# Altium schematic sheet PAGE03_POWER SUPPLY.SchDoc
size 330 x 203 mm
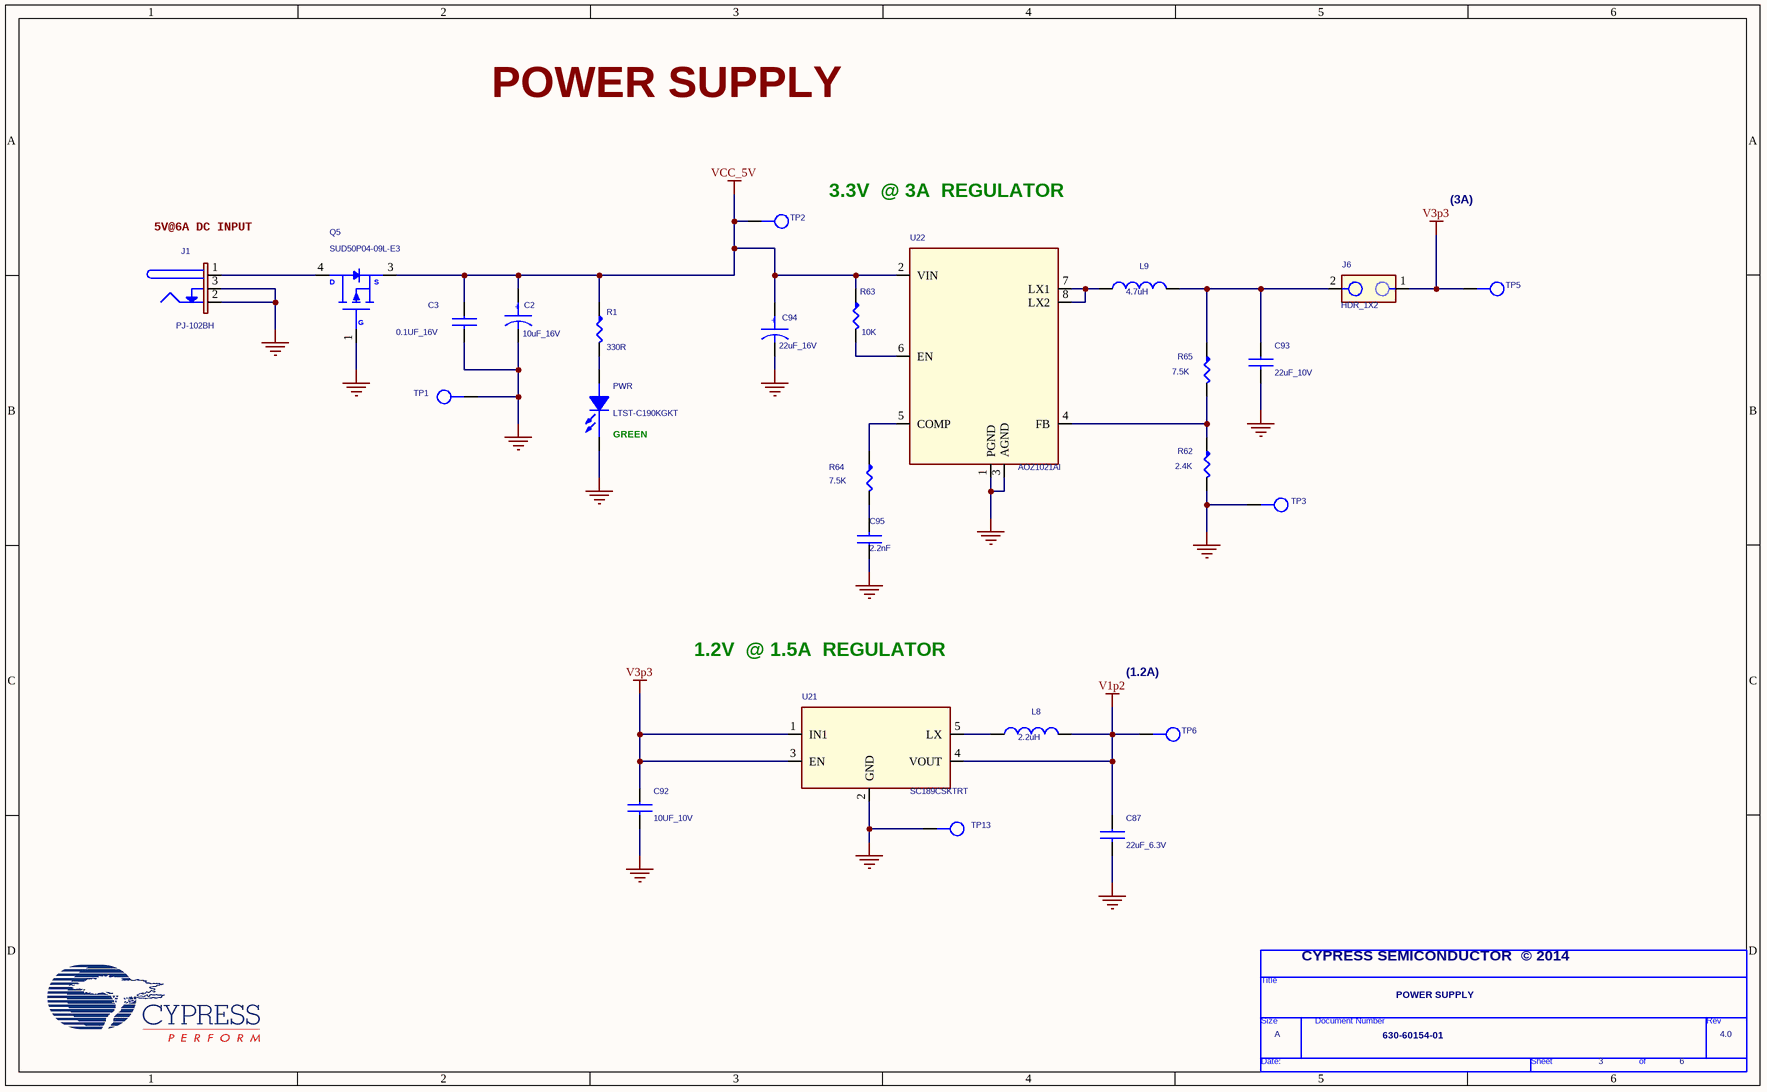
[diagram p0: PAGE03_POWER SUPPLY.SchDoc]

## Parts
*  Page Count: 6  Page Number: 3  Page Size: A  Title: POWER SUPPLY  RevCode: 4.0  Doc: 630-60154-01  (hidden comment: TitleBlock0)  (graphical)
C2  10uF_16V  [CAPMP3216X180M]
C3  0.1UF_16V  [CAPC1005X56M]
C87  22uF_6.3V  [CAPC3216X100M]
C92  10UF_10V  [CAPC2012X145M]
C93  22uF_10V  [CAPC3216X100M]
C94  22uF_16V  [CAPCP3216X100M]
C95  2.2nF  [CAPC2112X70M]
J1  PJ-102BH  [CUI_PJ-102BH]
J6  HDR_1X2  [SAMTEC_TSW-102-08-G-S]
L8  2.2uH  [INDP3225X240M]
L9  4.7uH  [IND_NR6028T4R7M]
PWR  LTST-C190KGKT  [LEDC1608X80M]
Q5  SUD50P04-09L-E3  [TO228P991X238-3M]
R1  330R  [RESC1608X55M]
R62  2.4K  [RESC1608X55M]
R63  10K  [RESC1608X55M]
R64  7.5K  [RESC1608X55M]
R65  7.5K  [RESC1608X55M]
TP1  TP_BLACK  [KEYSTONE_5000]  (value not drawn)
TP2  TP_RED  [KEYSTONE_5000]  (value not drawn)
TP3  TP_BLACK  [KEYSTONE_5000]  (value not drawn)
TP5  TP_RED  [KEYSTONE_5000]  (value not drawn)
TP6  TP_RED  [KEYSTONE_5000]  (value not drawn)
TP13  TP_BLACK  [KEYSTONE_5000]  (value not drawn)
U21  SC189CSKTRT  [SOT95P280X145-5M]
U22  AOZ1021AI  [SOIC127P600X175-8M]

## Nets
GND: C2.2 C3.2 C87.2 C92.2 C93.2 C94.2 C95.1 J1.2 J1.3 PWR.2(CATHODE) Q5.1(G) R62.2 TP1.1(TP) TP3.1(TP) TP13.1(TP) U21.2(GND) U22.1(PGND) U22.3(AGND)
V1p2: C87.1 L8.2 TP6.1(TP) U21.4(VOUT)
V3p3: C92.1 J6.1 TP5.1(TP) U21.1(IN1) U21.3(EN)
VCC_5V: C2.1 C3.1 C94.1 Q5.3(S) R1.1 R63.1 TP2.1(TP) U22.2(VIN)
NetC93_1: C93.1 J6.2 L9.2 R65.1
NetC95_2: C95.2 R64.2
NetJ1_1: J1.1 Q5.4(D)
NetL8_1: L8.1 U21.5(LX)
NetL9_1: L9.1 U22.7(LX1) U22.8(LX2)
NetPWR_1: PWR.1(ANODE) R1.2
NetR62_1: R62.1 R65.2 U22.4(FB)
NetR63_2: R63.2 U22.6(EN)
NetR64_1: R64.1 U22.5(COMP)

## Notes on the sheet
- POWER SUPPLY
- (near J1) 5V@6A DC INPUT
- 3.3V  @ 3A  REGULATOR
- (3A)
- (near PWR) GREEN
- 1.2V  @ 1.5A  REGULATOR
- (1.2A)
- (near *) CYPRESS SEMICONDUCTOR  © 2014
- (in symbol CAP POL) +
- (in symbol TitleBlock0) Title; Size; Document Number; Rev; Date:; Sheet; of

## Library data of the parts
C2 = CAP POL: CAP TANT 10UF 16V 20% 1206; Part Number: TAJA106M016RNJ; Manufacturer: AVX Corporation; Lead Free: YES; Decription: CAP TANT 10UF 16V 20% 1206
C3 C87 C92 C93 = CAPACITOR NON-POL: Manufacturer: *; Part Number: *
C94 = CAP POL: CAP TANT 22UF 16V 10% 1206; Manufacturer: Nichicon; Part Number: F951C226KQAAQ2; RoHS Compliant: Yes; Lead Free Status: No
C95 = CAPACITOR NON-POL: CAP CER 2200PF 50V 10% X7R 0805; Manufacturer: Yageo; Part Number: CC0805KRX7R9BB222; Num Pins: 2; RoHS Compliant: Yes; Lead Free: YES
J1 = PowerJack: CONN PWR JACK 2.5X5.5MM HIGH CUR; Manufacturer: CUI Inc; LEAD FREE: Y; Type: Power Jack; MFG:: CUI Inc; Part Number: PJ-102BH
J6 = HEADER_1x2: Manufacturer: Samtec Inc; Part Number: TSW-102-08-G-S; Lead Free: YES
L8 = INDUCTOR: INDUCTOR 2.2UH 1.20A 20% 1210; Part Number: NLCV32T-2R2M-PFR; Manufacturer: TDK Corporation; Lead Free: YES
L9 = INDUCTOR: INDUCTOR 4.7UH 2.7A 20% SMD; Part Number: NR6028T4R7M; Manufacturer: Taiyo Yuden; Lead Free: YES
PWR = LED: LED GREEN CLEAR 0603 SMD; Manufacturer: Lite-On; Voltage Rating: 2V; CURRENT: 20mA; Part Number: LTST-C190KGKT
R1 = R_Dup1: RES 180 OHM 1/16W 1% 0402 SMD; Manufacturer: Vishay; Part Number: CRCW0402180RFKED
R62 = R_Dup1: RES 2.4K OHM 1/10W 1% 0603 SMD; Manufacturer: Panasonic - ECG; Part Number: ERJ-3EKF2401V; Lead Free: YES
R63 = R_Dup1: RES 10.0K OHM 1/10W 1% 0603 SMD; Manufacturer: Panasonic - ECG; Part Number: ERJ-3EKF1002V; Lead Free: YES
R64 = R_Dup1: RES 7.5K OHM 1/10W 1% 0603 SMD; Part Number: ERJ-3EKF7501V; Manufacturer: Panasonic - ECG; Lead Free: YES
R65 = R_Dup1: RES 7.5K OHM 1/10W 1% 0603 SMD; Manufacturer: Panasonic - ECG; Part Number: ERJ-3EKF7501V; Lead Free: YES
TP1 = TP: TEST POINT PC MINI .040"D BLACK; Manufacturer: Keystone; PART_NUMBER: 5000
TP2 TP5 = TP: TEST POINT PC MINI .040"D RED; PART_NUMBER: 5000; Manufacturer: Keystone
TP3 = TP: TEST POINT PC MINI .040"D BLACK; PART_NUMBER: 5000; Manufacturer: Keystone
TP6 = TP: TEST POINT PC MINI .040"D RED; Manufacturer: Keystone; Part Number: 5000
TP13 = TP: TEST POINT PC MINI .040"D BLACK; Part Number: 5000; Manufacturer: Keystone
U21 = SC189CSKTRT: IC REG BUCK SYNC 1.2V SOT23-5; Manufacturer: Semtech; Part Number: SC189CSKTRT
U22 = AOZ1021AI: IC REG BUCK SYNC ADJ 3A 8SOIC; Manufacturer: Alpha & Omega Semiconductor Inc; Part Number: AOZ1021AI
* = TitleBlock0: Page Create Date: March  8, 1995
Q5 = SUD50P04-09L-E3: Manufacturer: *; Part Number: SUD50P04-09L-E3